# EAGLE design schematic (EAGLE 9.5.2)
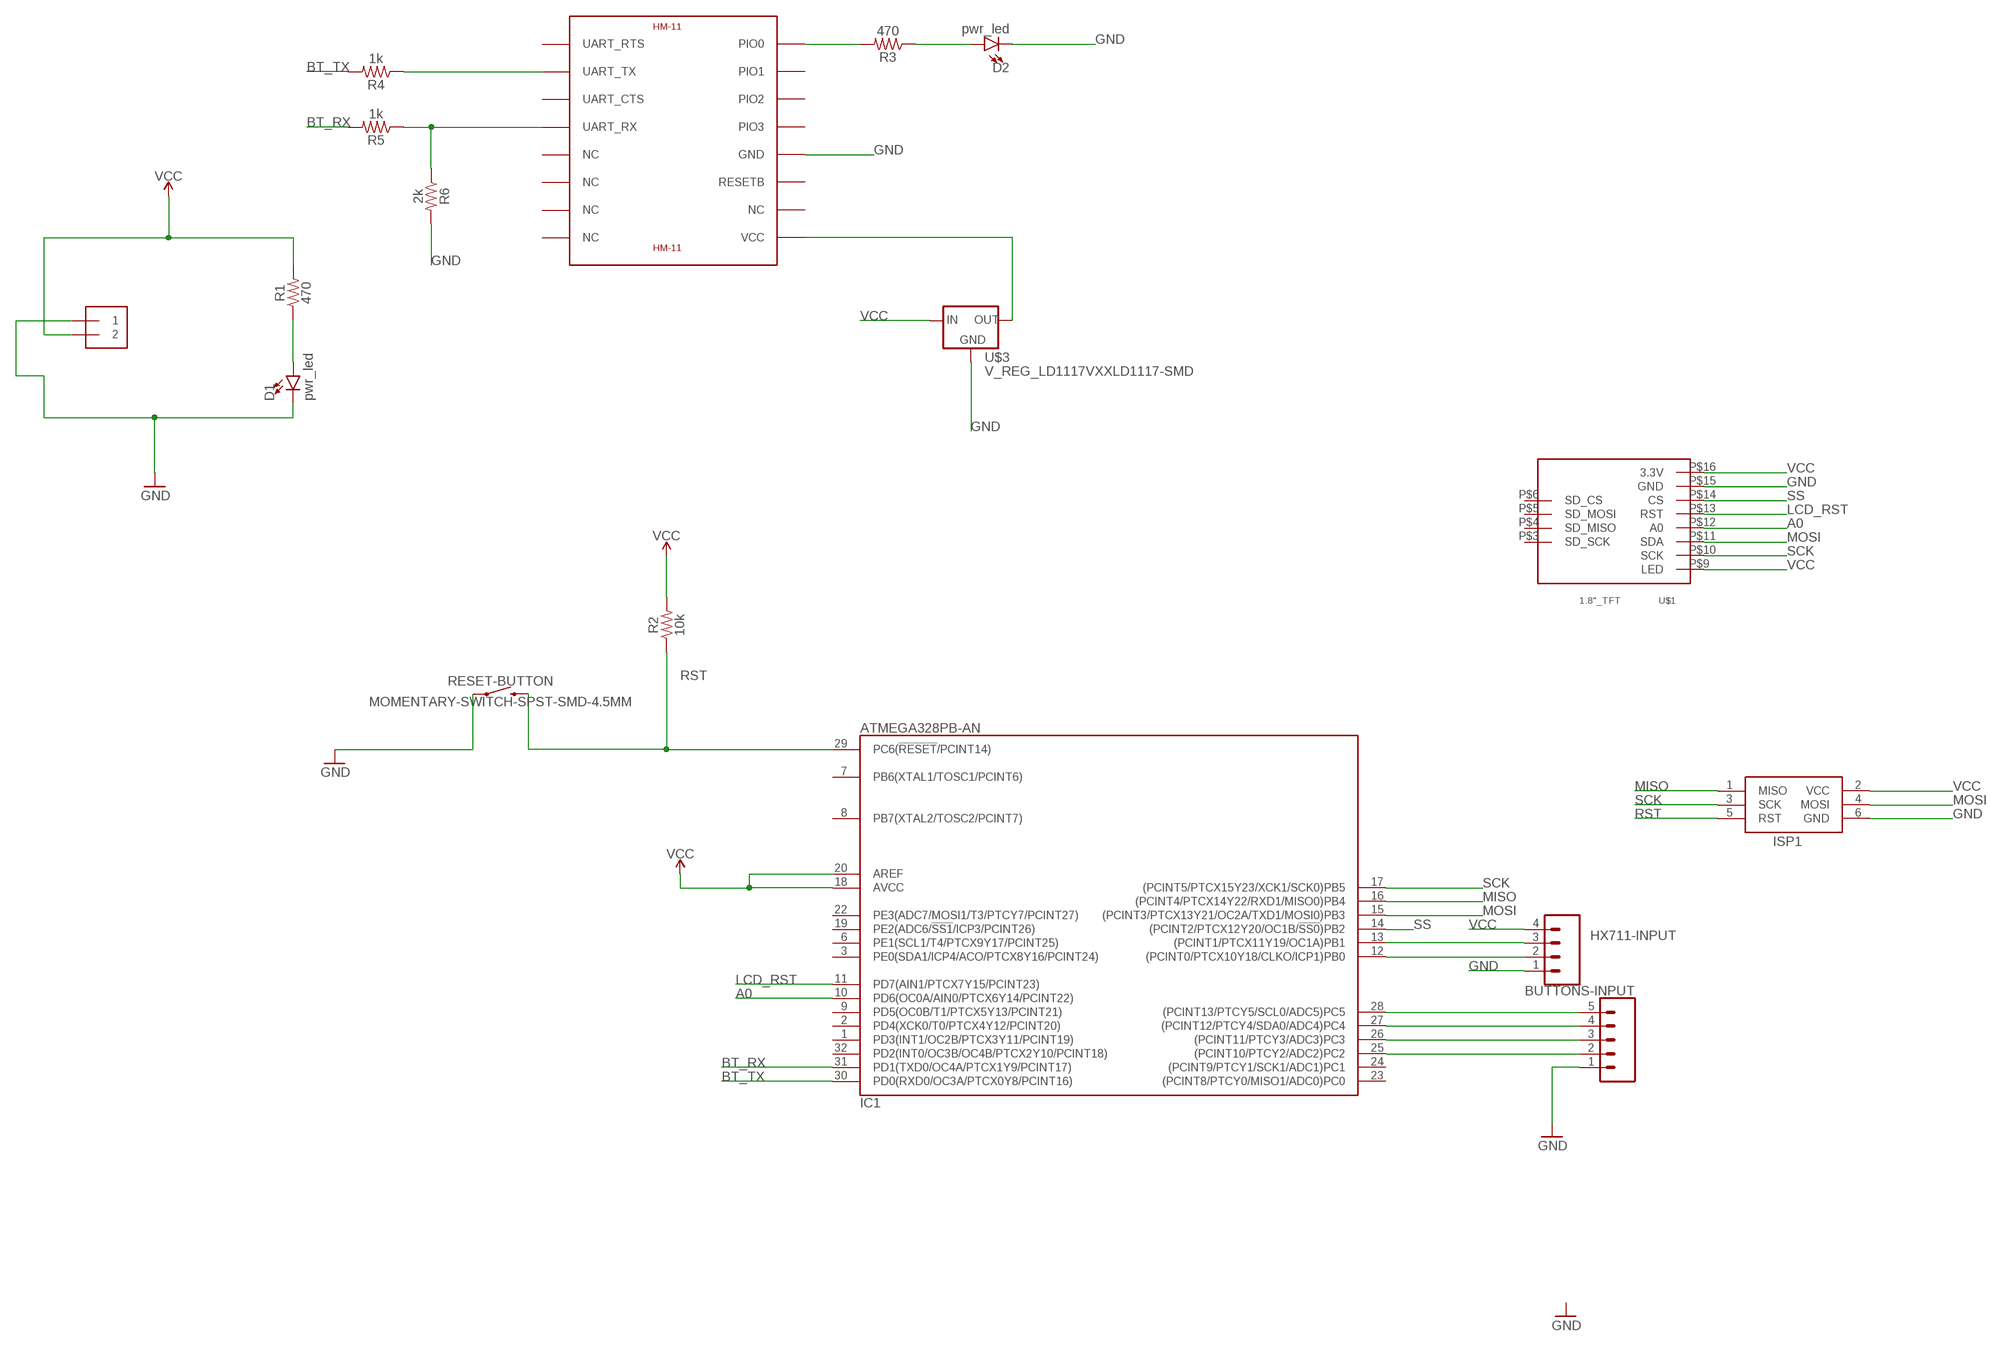
[diagram p0: schematic, sheet 1]

## Parts
BUTTONS-INPUT  CONN_05  [1X05]
D1  pwr_led  LED1206  [LED-1206]
D2  pwr_led  LED1206  [LED-1206]
HX711-INPUT  CONN_04LONGPADS  [1X04_LONGPADS]
IC1  ATMEGA328PB-AN  [QFP32_7X7_0.80]
ISP1  AVRISP-BOX  [AVRISP-BOX]
PWR  1X2-3.5MM  [1X2-3.5MM]
R1  470  RESISTOR1206  [1206]
R2  10k  RESISTOR1206  [1206]
R3  470  RESISTOR1206  [1206]
R4  1k  RESISTOR1206  [1206]
R5  1k  RESISTOR1206  [1206]
R6  2k  RESISTOR1206  [1206]
RESET-BUTTON  MOMENTARY-SWITCH-SPST-SMD-4.5MM  [TACTILE_SWITCH_SMD_4.5MM]
U$1  1.8"_TFT  [1.8"_TFT]
U$2  HM-11  [HM-11]
U$3  V_REG_LD1117VXXLD1117-SMD  [SOT223]

## Nets
A0: IC1.10(PD6(OC0A/AIN0/PTCX6Y14/PCINT22)) U$1.P$12(A0)
BT_RX: IC1.31(PD1(TXD0/OC4A/PTCX1Y9/PCINT17)) R5.2
BT_TX: IC1.30(PD0(RXD0/OC3A/PTCX0Y8/PCINT16)) R4.2
GND: BUTTONS-INPUT.1 D1.C D2.C HX711-INPUT.1 ISP1.6(GND) PWR.1 R6.2 RESET-BUTTON.2 RESET-BUTTON.3 U$1.P$15(GND) U$2.GND U$3.1(GND)
LCD_RST: IC1.11(PD7(AIN1/PTCX7Y15/PCINT23)) U$1.P$13(RST)
MISO: IC1.16((PCINT4/PTCX14Y22/RXD1/MISO0)PB4) ISP1.1(MISO)
MOSI: IC1.15((PCINT3/PTCX13Y21/OC2A/TXD1/MOSI0)PB3) ISP1.4(MOSI) U$1.P$11(SDA)
N$1: U$2.VCC U$3.2(OUT)
N$2: BUTTONS-INPUT.5 IC1.28((PCINT13/PTCY5/SCL0/ADC5)PC5)
N$3: D1.A R1.1
N$4: BUTTONS-INPUT.4 IC1.27((PCINT12/PTCY4/SDA0/ADC4)PC4)
N$5: BUTTONS-INPUT.3 IC1.26((PCINT11/PTCY3/ADC3)PC3)
N$6: BUTTONS-INPUT.2 IC1.25((PCINT10/PTCY2/ADC2)PC2)
N$7: HX711-INPUT.2 IC1.12((PCINT0/PTCX10Y18/CLKO/ICP1)PB0)
N$8: HX711-INPUT.3 IC1.13((PCINT1/PTCX11Y19/OC1A)PB1)
N$9: R3.2 U$2.PIO0
N$10: D2.A R3.1
N$11: R4.1 U$2.UART_TX
N$12: R5.1 R6.1 U$2.UART_RX
RST: IC1.29(PC6(!RESET!/PCINT14)) ISP1.5(RST) R2.1 RESET-BUTTON.1 RESET-BUTTON.4
SCK: IC1.17((PCINT5/PTCX15Y23/XCK1/SCK0)PB5) ISP1.3(SCK) U$1.P$10(SCK)
SS: IC1.14((PCINT2/PTCX12Y20/OC1B/!SS0!)PB2) U$1.P$14(CS)
VCC: HX711-INPUT.4 IC1.18(AVCC) IC1.20(AREF) ISP1.2(VCC) PWR.2 R1.2 R2.2 U$1.P$9(LED) U$1.P$16(3.3V) U$3.3(IN)
Unconnected: IC1.1(PD3(INT1/OC2B/PTCX3Y11/PCINT19)) IC1.2(PD4(XCK0/T0/PTCX4Y12/PCINT20)) IC1.3(PE0(SDA1/ICP4/ACO/PTCX8Y16/PCINT24)) IC1.6(PE1(SCL1/T4/PTCX9Y17/PCINT25)) IC1.7(PB6(XTAL1/TOSC1/PCINT6)) IC1.8(PB7(XTAL2/TOSC2/PCINT7)) IC1.9(PD5(OC0B/T1/PTCX5Y13/PCINT21)) IC1.19(PE2(ADC6/!SS1!/ICP3/PCINT26)) IC1.22(PE3(ADC7/MOSI1/T3/PTCY7/PCINT27)) IC1.23((PCINT8/PTCY0/MISO1/ADC0)PC0) IC1.24((PCINT9/PTCY1/SCK1/ADC1)PC1) IC1.32(PD2(INT0/OC3B/OC4B/PTCX2Y10/PCINT18)) U$1.P$3(SD_SCK) U$1.P$4(SD_MISO) U$1.P$5(SD_MOSI) U$1.P$6(SD_CS) U$2.NC@5(NC) U$2.NC@6(NC) U$2.NC@7(NC) U$2.NC@8(NC) U$2.NC@10(NC) U$2.PIO1 U$2.PIO2 U$2.PIO3 U$2.RESETB U$2.UART_CTS U$2.UART_RTS

## Power pins joined to a net without a drawn wire
GND: IC1.5(GND) IC1.21(GND)
VCC: IC1.4(VCC)

## Library data of the parts
BUTTONS-INPUT = SparkFun-Connectors:CONN_05: Multi connection point. Often used as Generic Header-pin footprint for 0.1 inch spaced/style header connections On any of the 0.1 inch spaced packages, you can populate with these: Break Away Headers - Straight <https://www.sparkfun.com/products/116> (PRT-00116) Break Away Male Headers - Right Angle <https://www.sparkfun.com/products/553> (PRT-00553) Female Headers <https://www.sparkfun.com/products/115> (PRT-00115) Break Away Headers - Machine Pin <https://www.sparkfun.com/products/117> (PRT-00117) Break Away Female Headers - Swiss Machine Pin <https://www.sparkfun.com/products/743> (PRT-00743) For SCREWTERMINALS and SPRING TERMINALS visit here: Screw Terimnals on SparkFun.com <https://www.sparkfun.com/search/results?term=Screw+Terminals> (5mm/3.5mm/2.54mm spacing) This device is also useful as a general connection point to wire up your design to another part of your project. Our various solder wires solder well into these plated through hole pads. Hook-Up Wire - Assortment (Stranded, 22 AWG) <https://www.sparkfun.com/products/11375> (PRT-11375) Hook-Up Wire - Assortment (Solid Core, 22 AWG) <https://www.sparkfun.com/products/11367> (PRT-11367) View the entire wire category on our website here <https://www.sparkfun.com/categories/141> Special notes: Molex polarized connector foot print use with SKU : PRT-08231 with associated crimp pins and housings. 1MM SMD Version SKU: PRT-10208
D1 D2 = SparkFun-LED:LED: LED (Generic) Standard schematic elements and footprints for 5mm, 3mm, 1206, and 0603 sized LEDs. Generic LEDs with no color specified.
HX711-INPUT = SparkFun-Connectors:CONN_04: Multi connection point. Often used as Generic Header-pin footprint for 0.1 inch spaced/style header connections On any of the 0.1 inch spaced packages, you can populate with these: Break Away Headers - Straight <https://www.sparkfun.com/products/116> (PRT-00116) Break Away Male Headers - Right Angle <https://www.sparkfun.com/products/553> (PRT-00553) Female Headers <https://www.sparkfun.com/products/115> (PRT-00115) Break Away Headers - Machine Pin <https://www.sparkfun.com/products/117> (PRT-00117) Break Away Female Headers - Swiss Machine Pin <https://www.sparkfun.com/products/743> (PRT-00743) For SCREWTERMINALS and SPRING TERMINALS visit here: Screw Terimnals on SparkFun.com <https://www.sparkfun.com/search/results?term=Screw+Terminals> (5mm/3.5mm/2.54mm spacing) This device is also useful as a general connection point to wire up your design to another part of your project. Our various solder wires solder well into these plated through hole pads. Hook-Up Wire - Assortment (Stranded, 22 AWG) <https://www.sparkfun.com/products/11375> (PRT-11375) Hook-Up Wire - Assortment (Solid Core, 22 AWG) <https://www.sparkfun.com/products/11367> (PRT-11367) View the entire wire category on our website here <https://www.sparkfun.com/categories/141> Special notes: Molex polarized connector foot print use with SKU : PRT-08231 with associated crimp pins and housings. 1MM SMD Version SKU: PRT-10208; PROD_ID: CONN-09696
IC1 = atmel:ATMEGA328PB: 8-bit AVR Microcontroller 32kbytes flash 2kbytes SRAM 1kbyte EEPROM USART 8-channel 10 bit ADC
ISP1 = adafruit:AVRISP: AVR ISP HEADER Standard 6 pin header for AVR programming
PWR = adafruit:1X2: 3.5mm Terminal block http://www.ladyada.net/library/pcb/eaglelibrary.html
R1-R6 = SparkFun-Resistors:RESISTOR: Generic Resistor Package
RESET-BUTTON = SparkFun-Switches:MOMENTARY-SWITCH-SPST: Momentary Switch (Pushbutton) - SPST Normally-open (NO) SPST momentary switches (buttons, pushbuttons). Variants PTH-12MM - 12mm square, through-hole Momentary Pushbutton Switch - 12mm Square <https://www.sparkfun.com/products/9190> (COM-09190) PTH-6.0MM, PTH-6.0MM-KIT - 6.0mm square, through-hole Mini Pushbutton Switch <https://www.sparkfun.com/products/97> (COM-00097) KIT package intended for soldering kit's - only one side of pads' copper is exposed. PTH-RIGHT-ANGLE-KIT - Right-angle, through-hole Right Angle Tactile Button <https://www.sparkfun.com/products/10791> - Used on SparkFun BigTime Watch Kit <https://www.sparkfun.com/products/11734> SMD-12MM - 12mm square, surface-mount Tactile Button - SMD (12mm) <https://www.sparkfun.com/products/12993> (COM-12993) Used on SparkFun PicoBoard <https://www.sparkfun.com/products/11888> SMD-4.5MM - 4.5mm Square Trackball Switch Used on SparkFun Blackberry Trackballer Breakout <https://www.sparkfun.com/products/13169> SMD-4.6MMX2.8MM - 4.60mm x 2.80mm, surface mount Used on SparkFun SAMD21 Mini Breakout <https://www.sparkfun.com/products/13664> SMD-5.2MM, SMD-5.2-REDUNDANT - 5.2mm square, surface-mount Mini Pushbutton Switch - SMD <https://www.sparkfun.com/products/8720> (COM-08720) Used on Arduino Pro Mini <https://www.sparkfun.com/products/11114> REDUNDANT package connects both switch circuits together SMD-6.0X3.5MM - 6.0 x 3.5mm, surface mount Momentary Reset Switch SMD <https://www.sparkfun.com/products/8229> (COM-08229) SMD-6.2MM-TALL - 6.2mm square, surface mount Tactile Button - SMD (6mm) <https://www.sparkfun.com/products/12992> Used on SparkFun Digital Sandbox <https://www.sparkfun.com/products/12651> SMD-RIGHT-ANGLE - Right-angle, surface mount Used on SparkFun Block for Intel® Edison - Arduino <https://www.sparkfun.com/products/13036>; PROD_ID: SWCH-09213
U$1 = tft_1.8_1.44_oled_0.96:1.8"_TFT
U$2 = hm-11:HM-11: JNHuaMao HM-11 Bluetooth 4.0 Transceiver based on TI CC2540/CC2541
U$3 = SparkFun-IC-Power:V_REG_LD1117VXX: LD1117VXX voltage regulator. We carry the 3.3V version (COM-00526) in TO-220 package.; PROD_ID: VREG-13917

## Board
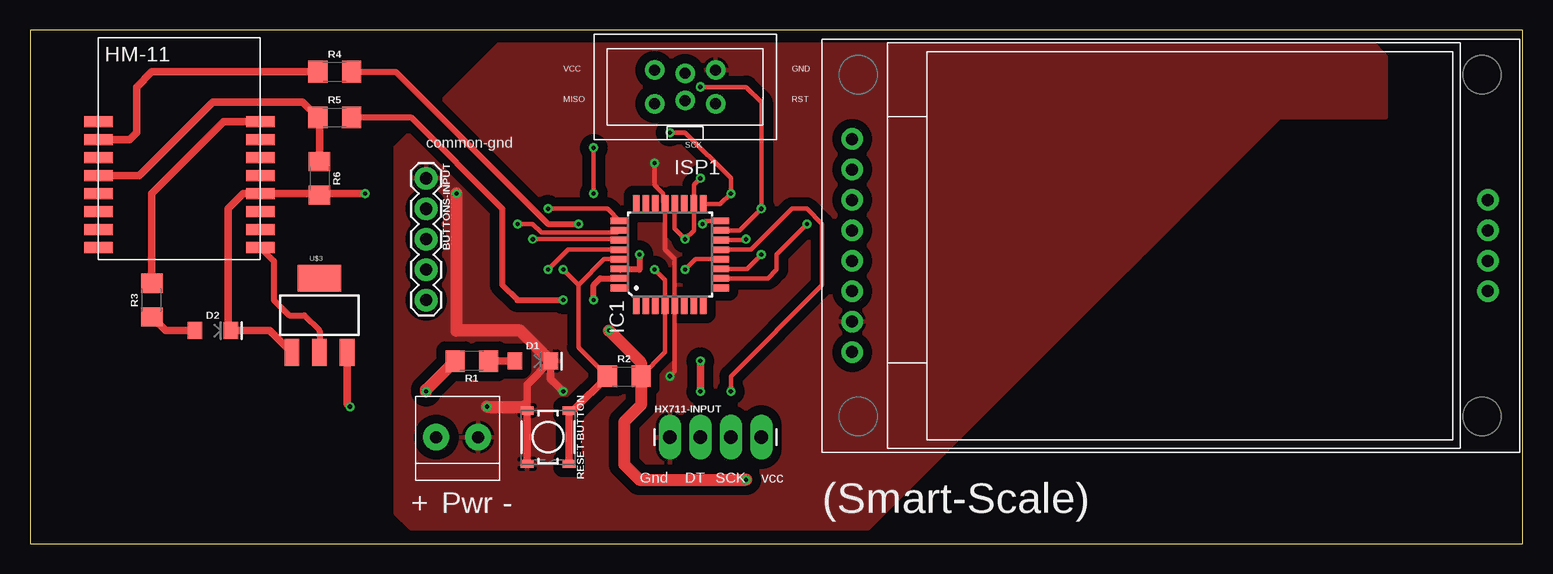
[diagram p1: board, top side]
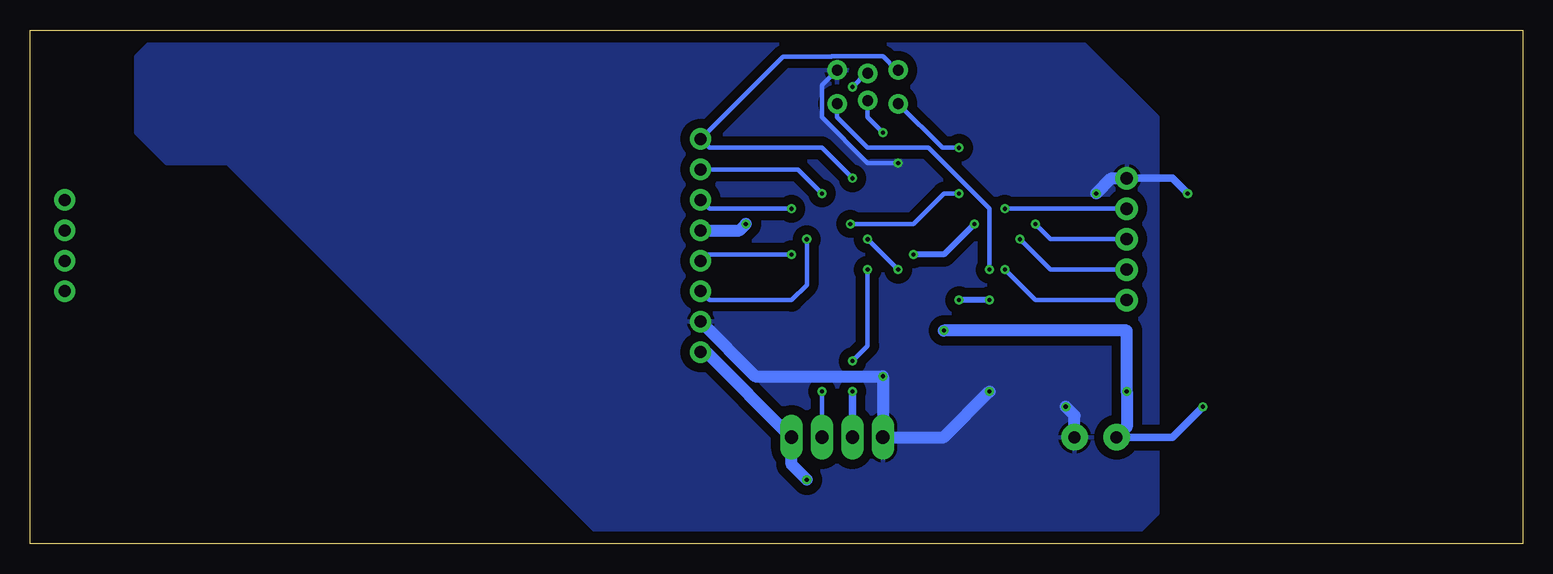
[diagram p2: board, bottom side, seen from below]

Size 124.44 x 42.85 mm. Coordinates in mm from the lower left corner, seen from the top.
Outline: 0,0 124.44,0 124.44,42.85 0,42.85 0,0
Copper layers (1*16): Top 0.035mm / dielectric 1.5mm / Bottom 0.035mm
Design rules "default": minimum track width 6mil, minimum drill 0.35mm, track to track 6mil, track to pad 6mil, pad to pad 6mil, via to via 6mil, smd to smd 6mil, copper to edge 40mil, drill to drill 6mil, minimum pad ring 10mil, minimum via ring 8mil, stop-mask expansion 4mil, vias tented up to drill 0mil, thermal gap 10mil

### Footprints (pad centres in the part's own frame; a part is rotated, then mirrored left to right if it is on the bottom)
1X05 = drill 1.016 pad 1.88: 1 0,0; 2 2.54,0; 3 5.08,0; 4 7.62,0; 5 10.16,0
LED-1206 = smd 1.2 x 1.4: A -1.5,0; C 1.5,0
1X04_LONGPADS = drill 1.118 pad 1.88 long: 1 0,0; 2 2.54,0; 3 5.08,0; 4 7.62,0
QFP32_7X7_0.80 = smd 1.5 x 0.55: 1 -4.2,2.8; 2 -4.2,2; 3 -4.2,1.2; 4 -4.2,0.4; 5 -4.2,-0.4; 6 -4.2,-1.2; 7 -4.2,-2; 8 -4.2,-2.8; 17 4.2,-2.8; 18 4.2,-2; 19 4.2,-1.2; 20 4.2,-0.4; 21 4.2,0.4; 22 4.2,1.2; 23 4.2,2; 24 4.2,2.8 | smd 0.55 x 1.5: 9 -2.8,-4.2; 10 -2,-4.2; 11 -1.2,-4.2; 12 -0.4,-4.2; 13 0.4,-4.2; 14 1.2,-4.2; 15 2,-4.2; 16 2.8,-4.2; 25 2.8,4.2; 26 2,4.2; 27 1.2,4.2; 28 0.4,4.2; 29 -0.4,4.2; 30 -1.2,4.2; 31 -2,4.2; 32 -2.8,4.2
AVRISP-BOX = drill 0.9 pad 1.626: 1 -1.397,2.54; 2 1.397,2.54; 3 -1.143,0; 4 1.143,0; 5 -1.397,-2.54; 6 1.397,-2.54
1X2-3.5MM = drill 1 pad 2.184: 1 1.8,0; 2 -1.7,0
1206 = smd 1.6 x 1.8: 1 -1.4,0; 2 1.4,0
TACTILE_SWITCH_SMD_4.5MM = smd 0.7 x 1.1: 1 2.225,1.75; 2 2.225,-1.75; 3 -2.225,-1.75; 4 -2.225,1.75
1.8"_TFT = drill 1 pad 1.778: P$3 55.5,21.05; P$4 55.5,18.52; P$5 55.5,15.98; P$6 55.5,13.44; P$9 2.5,26.14; P$10 2.5,23.6; P$11 2.5,21.06; P$12 2.5,18.52; P$13 2.5,15.98; P$14 2.5,13.44; P$15 2.5,10.9; P$16 2.5,8.36
HM-11 = smd 2.4 x 0.9: GND 6.5,0; NC@5 -7,0; NC@6 -7,-1.5; NC@7 -7,-3; NC@8 -7,-4.5; NC@10 6.5,-3; PIO0 6.5,6; PIO1 6.5,4.5; PIO2 6.5,3; PIO3 6.5,1.5; RESETB 6.5,-1.5; UART_CTS -7,3; UART_RTS -7,6; UART_RX -7,1.5; UART_TX -7,4.5; VCC 6.5,-4.5
SOT223 = smd 1.219 x 2.235: 1 -2.311,-3.099; 2 0,-3.099; 3 2.311,-3.099 | smd 3.6 x 2.2: 4 0,3.099

### Placement (x,y rotation side)
BUTTONS-INPUT  33.02,30.48 270 top
D1  41.91,15.24 0 top
D2  15.24,17.78 0 top
HX711-INPUT  53.34,8.89 0 top
IC1  53.34,24.13 90 top
ISP1  54.61,38.1 90 top
PWR  35.56,8.89 0 top
R1  36.83,15.24 180 top
R2  49.53,13.97 0 top
R3  10.16,20.32 90 top
R4  25.4,39.37 0 top
R5  25.4,35.56 0 top
R6  24.13,30.48 270 top
RESET-BUTTON  43.18,8.89 270 top
U$1  66.04,7.62 0 top
U$2  12.7,29.21 0 top
U$3  24.13,19.05 0 top

### Tracks (layer width: path | path; a pad name or v marks a point on that pad's centre or on a via)
A0  (via drill 0.35)
  Top 0.381: v64.77,26.67 62.23,24.13 62.23,22.86 61.5,22.13 IC1.10
  Bottom 1.016: U$1.P$12 65.3,26.14 v64.77,26.67
BT_RX  (via drill 0.35)
  Top 0.508: R5.2 31.75,35.56 39.37,27.94 39.37,21.59 40.64,20.32 v44.45,20.32 | v46.99,20.32 46.99,21.59 47.53,22.13 IC1.31
  Bottom 0.508: v44.45,20.32 v46.99,20.32
BT_TX  (via drill 0.35)
  Top 0.508: R4.2 30.48,39.37 43.18,26.67 v45.72,26.67 | v50.8,24.13 50.8,22.86 49.21,22.86 IC1.30
  Bottom 0.508: v45.72,26.67 48.26,24.13 v50.8,24.13
GND  (via drill 0.35)
  Top 0.381: v53.34,13.97 53.74,14.37 IC1.5 53.74,23.73 52.94,24.53 IC1.21 52.76,28.51 52.76,29.22 52.07,29.91 v52.07,31.75
  Top 0.635: RESET-BUTTON.2 RESET-BUTTON.3 41.43,13.26 D1.C 43.41,13.74 v44.45,12.7 | U$3.1 19.99,17.78 D2.C 16.51,18.01 16.51,27.94 17.78,29.21 U$2.GND 24,29.21 R6.2 24.26,29.21 v27.94,29.21
  Top 1.016: v38.1,11.43 41.12,11.43 RESET-BUTTON.3 | D1.C 40.87,17.78 35.56,17.78 v35.56,29.21
  Bottom 0.381: ISP1.6 58.42,38.23 58.42,35.56 54.61,31.75 v52.07,31.75
  Bottom 0.635: v27.94,29.21 29.21,30.48 BUTTONS-INPUT.1
  Bottom 1.016: v44.45,12.7 48.26,8.89 HX711-INPUT.1 v53.34,13.97 63.99,13.97 U$1.P$15 | PWR.1 37.36,10.69 v38.1,11.43 | v35.56,29.21 34.29,30.48 BUTTONS-INPUT.1
  pour Top (isolate 0.762): 39.37,41.91 30.48,33.02 30.48,2.54 31.75,1.27 69.85,1.27 73.66,5.08 104.14,35.56 113.03,35.56 113.03,40.64 111.76,41.91
  pour Bottom (isolate 0.762): 36.83,41.91 30.48,35.56 30.48,2.54 33.02,0 36.83,0 76.2,0 107.95,31.75 113.03,31.75 115.57,34.29 115.57,40.64 113.03,43.18 38.1,43.18
LCD_RST  (via drill 0.35)
  Top 0.381: IC1.11 59.76,22.93 v60.96,24.13
  Bottom 0.381: v60.96,24.13 68.01,24.13 U$1.P$13
MISO  (via drill 0.35)
  Top 0.381: v56.06,26.67 56.32,26.93 IC1.16 | v46.99,33.02 v46.99,29.21
  Bottom 0.381: v56.06,26.67 50.8,26.67 48.26,29.21 v46.99,29.21 | ISP1.1 48.39,33.02 v46.99,33.02
MOSI  (via drill 0.35)
  Top 0.381: IC1.15 59.15,26.13 v60.96,27.94 60.96,36.83 59.69,38.1 v55.88,38.1
  Bottom 0.381: U$1.P$11 67.8,27.94 v60.96,27.94 | ISP1.4 54.74,39.24 v55.88,38.1
N$1
  Top 0.508: U$2.VCC 20.32,23.59 20.32,20.32 21.59,19.05 22.86,19.05 24.13,17.78 U$3.2
N$2  (via drill 0.35)
  Top 0.381: v43.18,22.86 44.85,24.53 IC1.28
  Bottom 0.381: BUTTONS-INPUT.5 40.64,20.32 v43.18,22.86
N$3
  Top 0.635: R1.1 D1.A
N$4  (via drill 0.35)
  Top 0.381: v41.91,25.4 49.07,25.4 IC1.27
  Bottom 0.381: BUTTONS-INPUT.4 39.37,22.86 v41.91,25.4
N$5  (via drill 0.35)
  Top 0.381: v40.64,26.67 41.91,26.67 42.65,25.93 48.23,25.93 48.25,25.95 48.96,25.95 IC1.26
  Bottom 0.381: BUTTONS-INPUT.3 39.37,25.4 v40.64,26.67
N$6  (via drill 0.35)
  Top 0.381: v43.18,27.94 48.13,27.94 IC1.25
  Bottom 0.381: BUTTONS-INPUT.2 v43.18,27.94
N$7  (via drill 0.35)
  Top 0.381: v54.61,22.86 55.48,23.73 IC1.12
  Top 0.635: v55.88,12.7 v55.88,15.24
  Bottom 0.381: v55.88,15.24 54.61,16.51 v54.61,22.86
  Bottom 0.635: HX711-INPUT.2 v55.88,12.7
N$8  (via drill 0.35)
  Top 0.381: IC1.13 60.09,24.53 63.5,27.94 64.77,27.94 66.04,26.67 66.04,21.59 58.42,13.97 v58.42,12.7
  Bottom 0.381: v58.42,12.7 HX711-INPUT.3
N$9
  Top 0.635: U$2.PIO0 16.16,35.21 10.16,29.21 R3.2
N$10
  Top 0.635: D2.A 11.3,17.78 R3.1
N$11
  Top 0.635: U$2.UART_TX 8.31,33.71 8.89,34.29 8.89,38.1 10.16,39.37 R4.1
N$12
  Top 0.635: R6.1 24.13,35.43 R5.1 22.73,36.83 15.24,36.83 9.12,30.71 U$2.UART_RX
RST  (via drill 0.35)
  Top 0.381: IC1.29 47.86,23.73 45.72,21.59 | R2.1 45.72,16.38 45.72,21.59 | v44.45,22.86 45.72,21.59
  Top 0.635: RESET-BUTTON.1 RESET-BUTTON.4 45.27,11.12 R2.1
  Bottom 0.381: v44.45,22.86 44.45,27.94 49.53,33.02 54.61,33.02 57.15,35.56 ISP1.5
SCK  (via drill 0.35)
  Top 0.381: IC1.17 57.54,28.33 v58.42,29.21 58.42,30.48 54.61,34.29 v53.34,34.29
  Bottom 0.381: U$1.P$10 60.43,31.22 v58.42,29.21 | ISP1.3 54.61,35.56 v53.34,34.29
SS  (via drill 0.35)
  Top 0.381: IC1.14 59.62,25.33 v59.69,25.4
  Bottom 0.381: v59.69,25.4 59.69,21.59 60.96,20.32 67.8,20.32 U$1.P$14
VCC  (via drill 0.35)
  Top 0.381: R2.2 52.94,15.98 IC1.4 52.94,21.99 v52.07,22.86 | IC1.20 53.74,26.27 v54.61,25.4 55.34,26.13 IC1.18 55.34,29.94 v55.88,30.48
  Top 0.635: v26.67,11.43 26.44,11.66 U$3.3
  Top 1.016: R1.2 33.02,12.83 v33.02,12.7 | v48.26,17.78 50.93,15.11 R2.2 50.93,11.56 49.53,10.16 49.53,6.6 50.8,5.33 v59.69,5.33
  Bottom 0.381: v52.07,22.86 v54.61,25.4 | v55.88,30.48 58.42,33.02 67.8,33.02 U$1.P$9 61.66,40.64 57.64,40.64 57.63,40.65 53.35,40.65 52.2,39.5 ISP1.2
  Bottom 0.635: PWR.2 29.21,8.89 v26.67,11.43
  Bottom 1.016: PWR.2 33.02,9.73 v33.02,12.7 33.02,17.78 v48.26,17.78 | v59.69,5.33 60.96,6.6 HX711-INPUT.4 68.05,15.98 U$1.P$16

### Text on the board
tPlace: VCC | GND | MISO | RST | common-gnd | SCK | Gnd | DT | SCK | vcc | + | Pwr | - | (Smart-Scale)